# Altium schematic sheet DM35_Power_C_V1.0.SchDoc
size A4
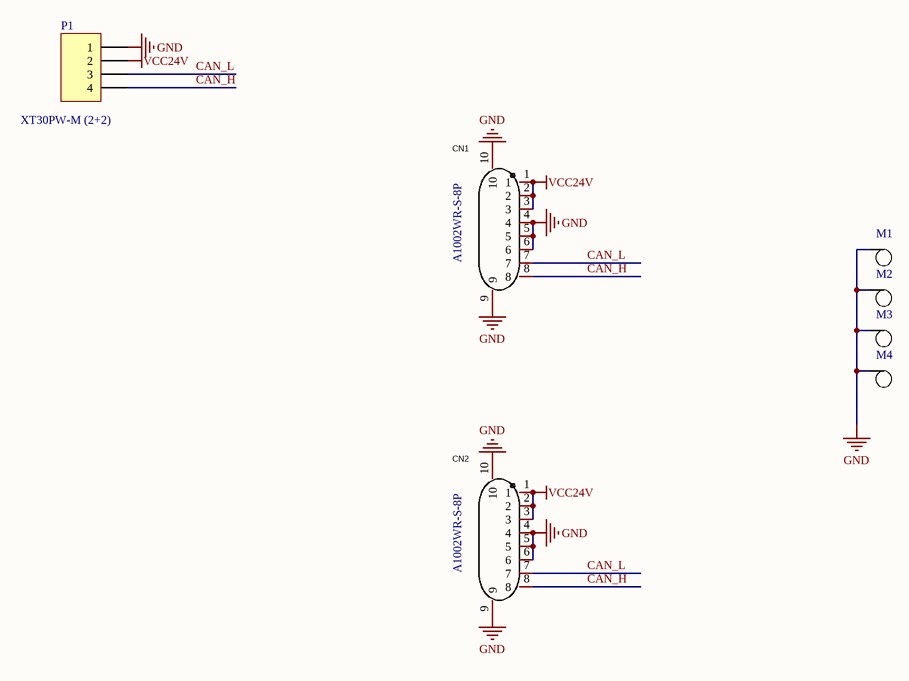
[diagram p0: DM35_Power_C_V1.0.SchDoc]

## Parts
CN1  A1002WR-S-8P  [CONN-SMD_A1002WR-S-8P]
CN2  A1002WR-S-8P  [CONN-SMD_A1002WR-S-8P]
M1  M2  [HOLE_PC4DC2P4]  (value not drawn)
M2  M2  [HOLE_PC4DC2P4]  (value not drawn)
M3  M2  [HOLE_PC4DC2P4]  (value not drawn)
M4  M2  [HOLE_PC4DC2P4]  (value not drawn)
P1  XT30PW-M (2+2)  [XT30PW-M (2+2)]

## Nets
GND: CN1.4 CN1.5 CN1.6 CN1.9 CN1.10 CN2.4 CN2.5 CN2.6 CN2.9 CN2.10 M1.0 M2.0 M3.0 M4.0 P1.1
VCC24V: CN1.1 CN1.2 CN1.3 CN2.1 CN2.2 CN2.3 P1.2
CAN_H: CN1.8 CN2.8 P1.4
CAN_L: CN1.7 CN2.7 P1.3

## Library data of the parts
CN1 CN2 = A1002WR-S-8P: Manufacturer: CJT(长江连接器); Add into BOM: yes; Connector Type: 接头; Pitch: 0.039"(1.00mm); Number of Positions: 8; Name: A1002WR-S-8P; Symbol: A1002WR-S-8P; Device: A1002WR-S-8P; LCSC Part Name: 8P,脚距1mm; Supplier Part: C239526; Manufacturer Part: A1002WR-S-8P; Supplier Footprint: SMD,P=1mm; JLCPCB Part Class: Extended Part; Datasheet: https://atta.szlcsc.com/upload/public/pdf/watermark/20190926/C239526_E6EB898D74B3D7AFB647860A542281E4.pdf; Supplier: LCSC; Convert to PCB: yes; Series: SH; Contact Type: 公形引脚; Number of Rows: 1; Row Spacing: -; Mounting Type: 表面贴装; Contact Material: 磷青铜
M1-M4 = Hole-M2.5
P1 = Header 4: LatestRevisionDate: 17-Jul-2002; LatestRevisionNote: Re-released for DXP Platform.; Publisher: Altium Limited